# Altium schematic sheet Power_Supply_9V.SchDoc: +/- 9V LDOs
size A4; DocumentNumber: 2; SheetNumber: 2; SheetTotal: 8
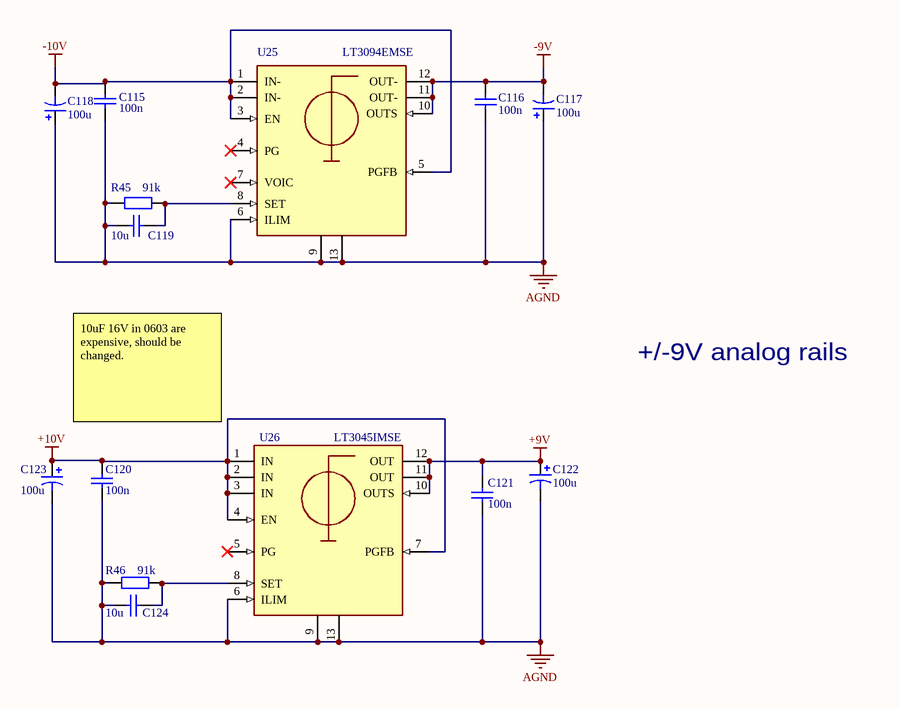
[diagram p0: Power_Supply_9V.SchDoc]

## Parts
C115  100n  [PCB-rf0pzaa82dpbeu9l4sxm-1]
C116  100n  [PCB-rf0pzaa82dpbeu9l4sxm-1]
C117  100u  [PCB-9bfrndi9huxo1n7cihpl-1]
C118  100u  [PCB-9bfrndi9huxo1n7cihpl-1]
C119  10u  [PCB-rf0pzaa82dpbeu9l4sxm-1]
C120  100n  [PCB-rf0pzaa82dpbeu9l4sxm-1]
C121  100n  [PCB-rf0pzaa82dpbeu9l4sxm-1]
C122  100u  [PCB-9bfrndi9huxo1n7cihpl-1]
C123  100u  [PCB-9bfrndi9huxo1n7cihpl-1]
C124  10u  [PCB-rf0pzaa82dpbeu9l4sxm-1]
R45  91k  [PCB-3d5y3t7f8drf35yjcj59-1]
R46  91k  [PCB-3d5y3t7f8drf35yjcj59-1]
U25  LT3094EMSE  [PCB-wizual0g3wynqnqrtsvy-1]
U26  LT3045IMSE  [PCB-wov5llpgebpq1pwypz48-1]

## Nets
+9V: C121.2 C122.1 U26.10(OUTS) U26.11(OUT) U26.12(OUT)
+10V: C120.2 C123.1 U26.1(IN) U26.2(IN) U26.3(IN) U26.4(EN) U26.7(PGFB)
-9V: C116.2 C117.2 U25.10(OUTS) U25.11(OUT-) U25.12(OUT-)
-10V: C115.2 C118.2 U25.1(IN-) U25.2(IN-) U25.3(EN) U25.5(PGFB)
AGND: C115.1 C116.1 C117.1 C118.1 C119.2 C120.1 C121.1 C122.2 C123.2 C124.2 R45.2 R46.2 U25.6(ILIM) U25.9(GND) U25.13(GND) U26.6(ILIM) U26.9(GND) U26.13(GND)
NetC119_1: C119.1 R45.1 U25.8(SET)
NetC124_1: C124.1 R46.1 U26.8(SET)

Not connected (* = marked no-connect by the designer): U25 4(PG)* 7(VOIC)*; U26 5(PG)*

## Notes on the sheet
- 10uF 16V in 0603 are expensive, should be changed.
- +/-9V analog rails
- Title
- Size:
- Date:
- A4
- Number:
- Time:
- Revision:
- Sheet
- of
- File:

## Library data of the parts
C115 C116 C119-C121 C124 = CMP-x8hddryxw4o380xfi98v-1: Capacitor 0603; CustomComponentID: x8hddryxw4o380xfi98v; LCSC Part #: C19702
  C115 C116 C120 C121: LCSC Part #: C14663; LCSC Part #: C109474
  C119 C124: LCSC Part #: C25804; LCSC Part #: C21190; LCSC Part #: C81598; LCSC Part #: C1546
C117 C118 C122 C123 = CMP-6546a831a81eba81-4: In a Pack of 25, KEMET 100?F Electrolytic Capacitor 10V dc Through Hole - A758EK107M1AAAE016; Capacitance: 100 µF; Equivalent Series Resistance (ESR): 16.0 m?; Voltage Rating (DC): 10.0 V; Capacitance Tolerance: ±20%; Mounting Style: Through Hole; Size-Diameter: 6.30 mm; Size-Height: 8.00 mm; Operating Temperature: 105 °C (max); RoHS: Compliant; Manufacturer Part Number: A758EK107M1AAAE016; Octopart URL: https://octopart.com/a758ek107m1aaae016-kemet-75360318; OctopartID: 6546a831a81eba81
R45 R46 = CMP-xcu3s4ikiffkkgbeyow5-1: Resistor 0603; CustomComponentID: xcu3s4ikiffkkgbeyow5; LCSC Part #: C23265; LCSC Part #: C23345
U25 = CMP-cc5900e31f81139e-11: LDO Regulator Neg 0V to -19.5V 0.5A 12-Pin MSOP EP Tube; Manufacturer Part Number: LT3094EMSE#PBF; Lead-Free Status: Contains Lead; Octopart URL: https://octopart.com/lt3094emse%23pbf-analog+devices-95403590; Number of Pins: 12; Lifecycle Status: Active; RoHS: Compliant; OctopartID: a88b642e33ab774c
U26 = CMP-53899e0384ae8c4e-10: LDO Regulator Pos 0V to 20V 0.5A Automotive 12-Pin MSOP EP Tube; Manufacturer Part Number: LT3045IMSE#PBF; Lead-Free Status: Contains Lead; Output Current: 500 mA; RoHS: Compliant; OctopartID: 53899e0384ae8c4e; Octopart URL: https://octopart.com/lt3045imse%23pbf-analog+devices+%2F+linear+technology-75559489; Lifecycle Status: Active; Operating Temperature: -40.0 °C (min); Case/Package: MSOP; Number of Pins: 12